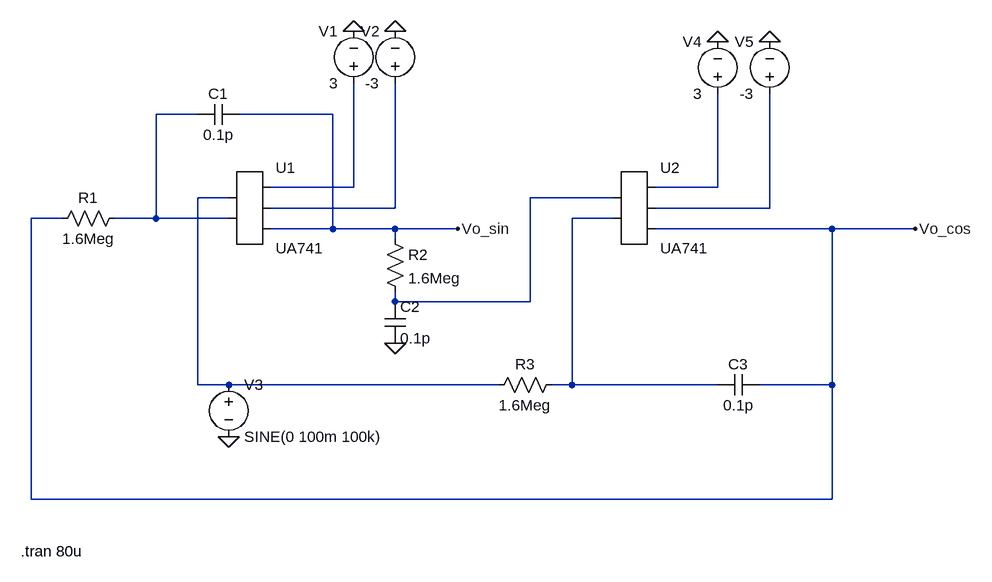
[diagram p0: schematic QuadratureOscillator_final.asc]
QuadratureOscillator_final.asc, the LTspice schematic file:
Version 4
SHEET 1 1188 680
WIRE -16 -32 -80 -32
WIRE 192 -32 48 -32
WIRE 224 80 224 -80
WIRE 224 80 96 80
WIRE 784 80 784 -64
WIRE 784 80 688 80
WIRE 32 96 -16 96
WIRE 624 96 496 96
WIRE 288 112 288 -80
WIRE 288 112 96 112
WIRE 864 112 864 -64
WIRE 864 112 688 112
WIRE -224 128 -272 128
WIRE -80 128 -80 -32
WIRE -80 128 -144 128
WIRE 32 128 -80 128
WIRE 624 128 560 128
WIRE 192 144 192 -32
WIRE 192 144 96 144
WIRE 288 144 192 144
WIRE 384 144 288 144
WIRE 960 144 688 144
WIRE 1088 144 960 144
WIRE 288 160 288 144
WIRE 288 256 288 240
WIRE 496 256 496 96
WIRE 496 256 288 256
WIRE -16 384 -16 96
WIRE 32 384 -16 384
WIRE 448 384 32 384
WIRE 560 384 560 128
WIRE 560 384 528 384
WIRE 784 384 560 384
WIRE 960 384 960 144
WIRE 960 384 848 384
WIRE -272 560 -272 128
WIRE 960 560 960 384
WIRE 960 560 -272 560
FLAG 224 -160 0
FLAG 288 -160 0
FLAG 288 320 0
FLAG 32 464 0
FLAG 784 -144 0
FLAG 864 -144 0
FLAG 384 144 Vo_sin
FLAG 1088 144 Vo_cos
SYMBOL AutoGenerated\\UA741 64 112 R0
SYMATTR InstName U1
SYMBOL cap 48 -48 R90
WINDOW 0 0 32 VBottom 2
WINDOW 3 32 32 VTop 2
SYMATTR InstName C1
SYMATTR Value 0.1p
SYMBOL res -128 112 R90
WINDOW 0 0 56 VBottom 2
WINDOW 3 32 56 VTop 2
SYMATTR InstName R1
SYMATTR Value 1.6Meg
SYMBOL voltage 224 -64 R180
WINDOW 0 24 96 Left 2
WINDOW 3 24 16 Left 2
WINDOW 123 0 0 Left 0
WINDOW 39 0 0 Left 0
SYMATTR InstName V1
SYMATTR Value 3
SYMBOL voltage 288 -64 R180
WINDOW 0 24 96 Left 2
WINDOW 3 24 16 Left 2
WINDOW 123 0 0 Left 0
WINDOW 39 0 0 Left 0
SYMATTR InstName V2
SYMATTR Value -3
SYMBOL res 544 368 R90
WINDOW 0 0 56 VBottom 2
WINDOW 3 32 56 VTop 2
SYMATTR InstName R3
SYMATTR Value 1.6Meg
SYMBOL AutoGenerated\\UA741 656 112 R0
SYMATTR InstName U2
SYMBOL res 272 144 R0
SYMATTR InstName R2
SYMATTR Value 1.6Meg
SYMBOL cap 272 256 R0
SYMATTR InstName C2
SYMATTR Value 0.1p
SYMBOL voltage 32 368 R0
WINDOW 123 0 0 Left 0
WINDOW 39 0 0 Left 0
SYMATTR InstName V3
SYMATTR Value SINE(0 100m 100k)
SYMBOL cap 848 368 R90
WINDOW 0 0 32 VBottom 2
WINDOW 3 32 32 VTop 2
SYMATTR InstName C3
SYMATTR Value 0.1p
SYMBOL voltage 784 -48 R180
WINDOW 0 24 96 Left 2
WINDOW 3 24 16 Left 2
WINDOW 123 0 0 Left 0
WINDOW 39 0 0 Left 0
SYMATTR InstName V4
SYMATTR Value 3
SYMBOL voltage 864 -48 R180
WINDOW 0 24 96 Left 2
WINDOW 3 24 16 Left 2
WINDOW 123 0 0 Left 0
WINDOW 39 0 0 Left 0
SYMATTR InstName V5
SYMATTR Value -3
TEXT -288 640 Left 2 !.tran 80u

The netlist it stands for:
* QuadratureOscillator_final.asc
* U1: UA741 (symbol AutoGenerated\UA741 not available, pins judged from their places): pin1=N004 pin2=N001 pin3=N002 pin4=N006 pin5=Vo_sin
C1 Vo_sin N001 0.1p
R1 N001 Vo_cos 1.6Meg
V1 N002 0 3
V2 N006 0 -3
R3 N008 N004 1.6Meg
* U2: UA741 (symbol AutoGenerated\UA741 not available, pins judged from their places): pin1=N005 pin2=N008 pin3=N003 pin4=N007 pin5=Vo_cos
R2 Vo_sin N005 1.6Meg
C2 N005 0 0.1p
V3 N004 0 SINE(0 100m 100k)
C3 Vo_cos N008 0.1p
V4 N003 0 3
V5 N007 0 -3
.tran 80u
.backanno
.end